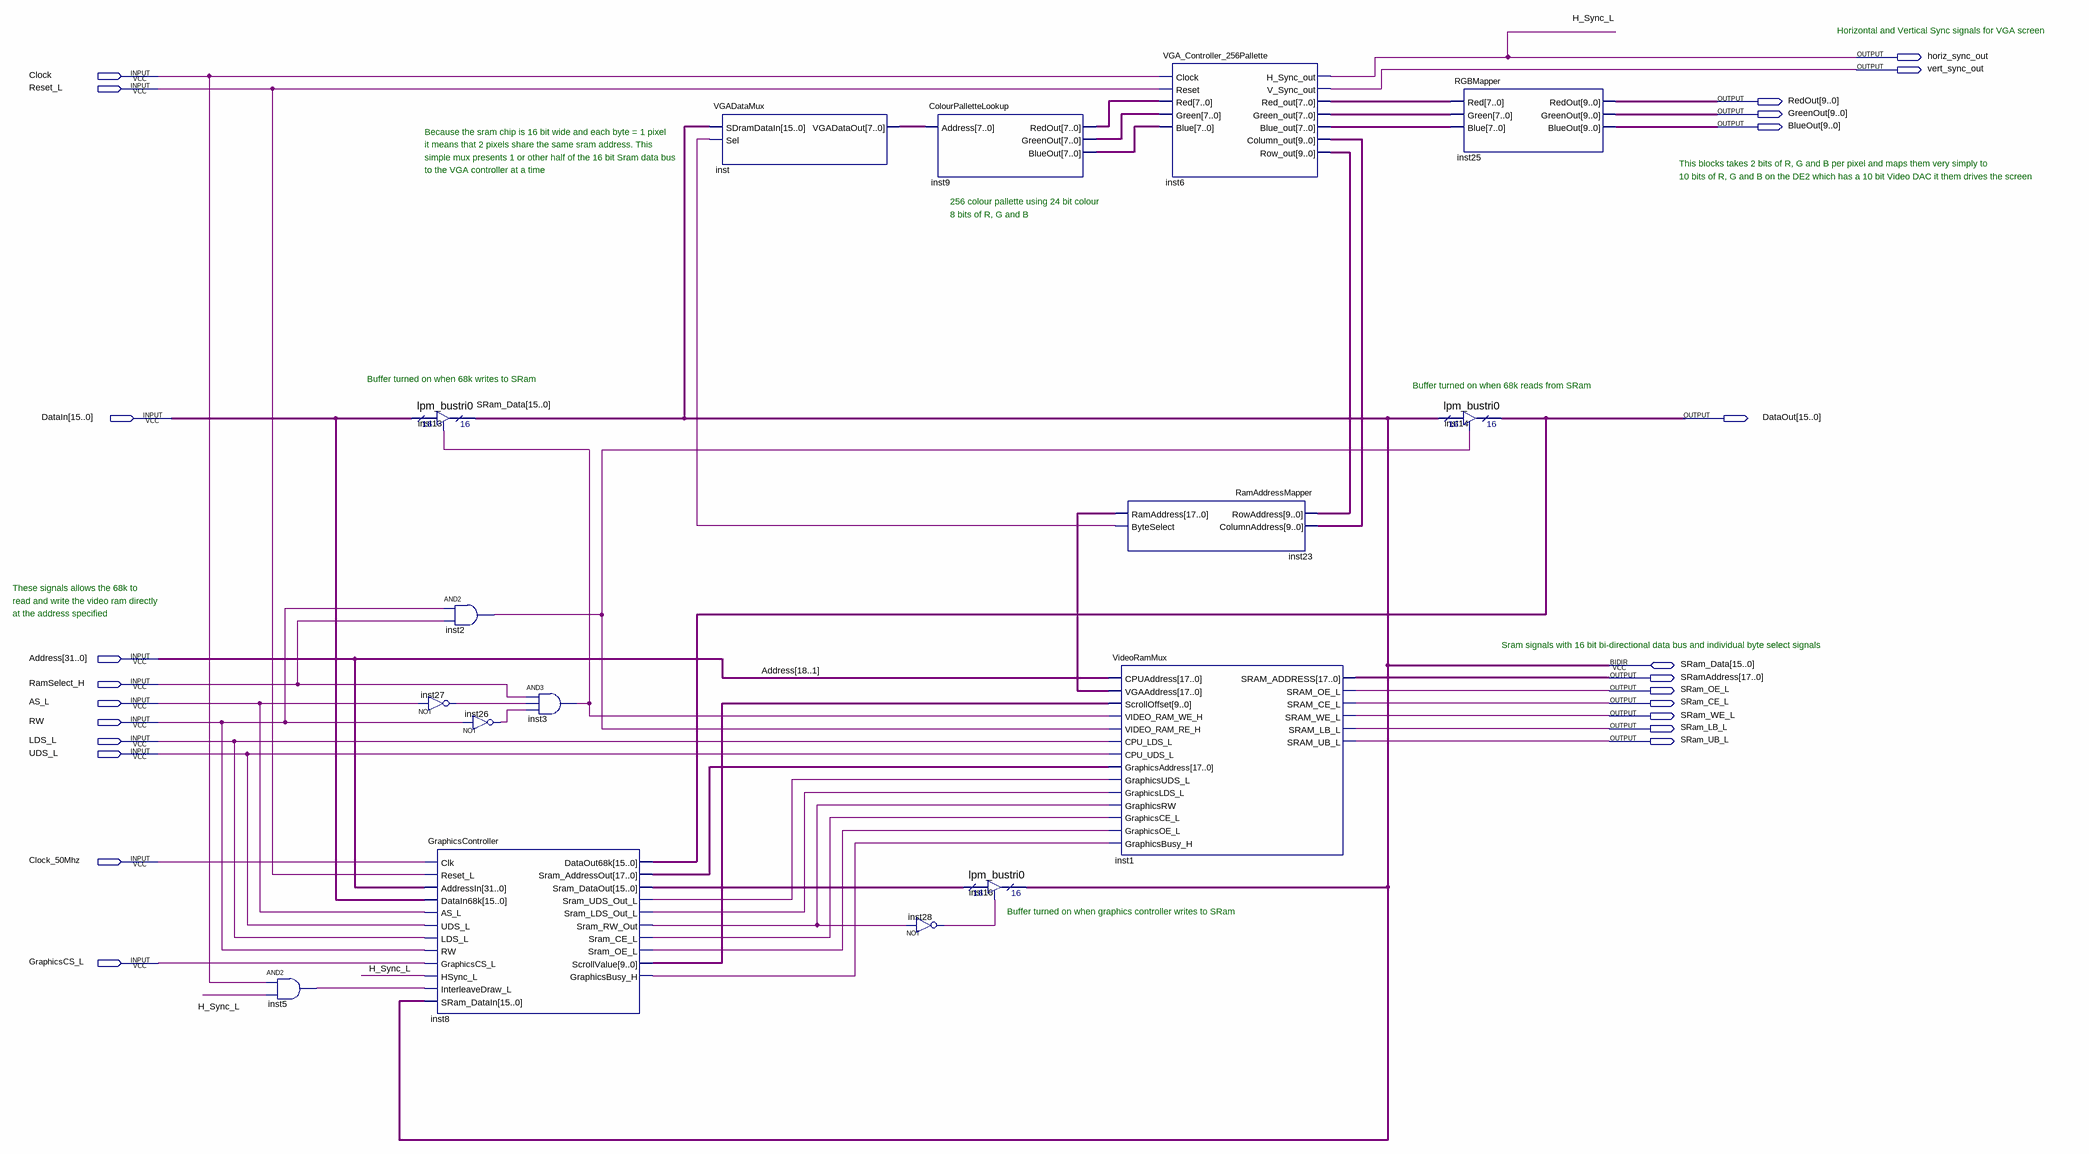
[diagram p0: schematic sheet]
// Quartus schematic Video_Controller640x480.bdf as structural Verilog: 16 symbols, 24 pins
module Video_Controller640x480 (
  input  Clock,
  input  Reset_L,
  input  [15:0] DataIn,
  input  [31:0] Address,
  input  RamSelect_H,
  input  AS_L,
  input  RW,
  input  LDS_L,
  input  UDS_L,
  input  Clock_50Mhz,
  input  GraphicsCS_L,
  inout  [15:0] SRam_Data,
  output horiz_sync_out,
  output vert_sync_out,
  output [9:0] RedOut,
  output [9:0] GreenOut,
  output [9:0] BlueOut,
  output [15:0] DataOut,
  output [17:0] SRamAddress,
  output SRam_OE_L,
  output SRam_CE_L,
  output SRam_WE_L,
  output SRam_LB_L,
  output SRam_UB_L
);

  wire inst2_out, inst3_out, inst5_out, inst8_graphicsbusy_h, inst8_sram_ce_l, inst8_sram_lds_out_l,
       inst8_sram_oe_l, inst8_sram_rw_out, inst8_sram_uds_out_l, inst23_byteselect, inst26_out, inst27_out,
       inst28_out;
  wire [7:0] inst6_blue_out, inst6_green_out, inst6_red_out, inst9_blueout, inst9_greenout, inst9_redout,
       inst_vgadataout;
  wire [9:0] inst6_column_out, inst6_row_out, inst8_scrollvalue;
  wire [15:0] inst8_sram_dataout;
  wire [17:0] inst8_sram_addressout, inst23_ramaddress;

  and inst5 (inst5_out, Clock, horiz_sync_out);
  lpm_bustri0 inst13 (.enabledt(inst3_out), .data(DataIn), .tridata(SRam_Data));
  not inst27 (inst27_out, AS_L);
  GraphicsController inst8 (
    .Clk(Clock_50Mhz), .Reset_L(Reset_L), .AddressIn(Address), .DataIn68k(DataIn), .AS_L(AS_L),
    .UDS_L(UDS_L), .LDS_L(LDS_L), .RW(RW), .GraphicsCS_L(GraphicsCS_L), .HSync_L(horiz_sync_out),
    .InterleaveDraw_L(inst5_out), .SRam_DataIn(SRam_Data), .DataOut68k(DataOut),
    .Sram_AddressOut(inst8_sram_addressout), .Sram_DataOut(inst8_sram_dataout),
    .Sram_UDS_Out_L(inst8_sram_uds_out_l), .Sram_LDS_Out_L(inst8_sram_lds_out_l),
    .Sram_RW_Out(inst8_sram_rw_out), .Sram_CE_L(inst8_sram_ce_l), .Sram_OE_L(inst8_sram_oe_l),
    .ScrollValue(inst8_scrollvalue), .GraphicsBusy_H(inst8_graphicsbusy_h));
  and inst2 (inst2_out, RW, RamSelect_H);
  not inst26 (inst26_out, RW);
  and inst3 (inst3_out, RamSelect_H, inst27_out, inst26_out);
  VGADataMux inst (.SDramDataIn(SRam_Data), .Sel(inst23_byteselect), .VGADataOut(inst_vgadataout));
  ColourPalletteLookup inst9 (
    .Address(inst_vgadataout), .RedOut(inst9_redout), .GreenOut(inst9_greenout), .BlueOut(inst9_blueout));
  not inst28 (inst28_out, inst8_sram_rw_out);
  lpm_bustri0 inst16 (.enabledt(inst28_out), .data(inst8_sram_dataout), .tridata(SRam_Data));
  RamAddressMapper inst23 (
    .RowAddress(inst6_row_out), .ColumnAddress(inst6_column_out), .RamAddress(inst23_ramaddress),
    .ByteSelect(inst23_byteselect));
  VideoRamMux inst1 (
    .CPUAddress(Address[18:1]), .VGAAddress(inst23_ramaddress), .ScrollOffset(inst8_scrollvalue),
    .VIDEO_RAM_WE_H(inst3_out), .VIDEO_RAM_RE_H(inst2_out), .CPU_LDS_L(LDS_L), .CPU_UDS_L(UDS_L),
    .GraphicsAddress(inst8_sram_addressout), .GraphicsUDS_L(inst8_sram_uds_out_l),
    .GraphicsLDS_L(inst8_sram_lds_out_l), .GraphicsRW(inst8_sram_rw_out), .GraphicsCE_L(inst8_sram_ce_l),
    .GraphicsOE_L(inst8_sram_oe_l), .GraphicsBusy_H(inst8_graphicsbusy_h), .SRAM_ADDRESS(SRamAddress),
    .SRAM_OE_L(SRam_OE_L), .SRAM_CE_L(SRam_CE_L), .SRAM_WE_L(SRam_WE_L), .SRAM_LB_L(SRam_LB_L),
    .SRAM_UB_L(SRam_UB_L));
  VGA_Controller_256Pallette inst6 (
    .Clock(Clock), .Reset(Reset_L), .Red(inst9_redout), .Green(inst9_greenout), .Blue(inst9_blueout),
    .H_Sync_out(horiz_sync_out), .V_Sync_out(vert_sync_out), .Red_out(inst6_red_out),
    .Green_out(inst6_green_out), .Blue_out(inst6_blue_out), .Column_out(inst6_column_out),
    .Row_out(inst6_row_out));
  RGBMapper inst25 (
    .Red(inst6_red_out), .Green(inst6_green_out), .Blue(inst6_blue_out), .RedOut(RedOut),
    .GreenOut(GreenOut), .BlueOut(BlueOut));
  lpm_bustri0 inst14 (.enabledt(inst2_out), .data(SRam_Data), .tridata(DataOut));

  // Other names for the same wires on the sheet: H_Sync_L = horiz_sync_out

  // Notes on the sheet:
  //   Horizontal and Vertical Sync signals for VGA screen
  //   Because the sram chip is 16 bit wide and each byte = 1 pixel
  //   it means that 2 pixels share the same sram address. This
  //   simple mux presents 1 or other half of the 16 bit Sram data bus 
  //   This blocks takes 2 bits of R, G and B per pixel and maps them very simply to 
  //   to the VGA controller at a time
  //   10 bits of R, G and B on the DE2 which has a 10 bit Video DAC it them drives the screen
  //   256 colour pallette using 24 bit colour
  //   8 bits of R, G and B
  //   Buffer turned on when 68k writes to SRam
  //   Buffer turned on when 68k reads from SRam
  //   These signals allows the 68k to 
  //   read and write the video ram directly
  //   at the address specified
  //   Sram signals with 16 bit bi-directional data bus and individual byte select signals
  //   Buffer turned on when graphics controller writes to SRam
endmodule
